# Altium schematic sheet CSI2-IMX8M-EVK-1_Rev02.SchDoc: CSI2-IMX8M-EVK
size A3; PageSetup: Record=PageOptions|CenterHorizontal=True|CenterVertical=True|PrintScale=0.73|XCorrection=1.00|YCorrection=1.00|PrintKind=2|BorderSize=5000000|LeftOffset=0|BottomOffset=0|Orientation=2|PaperLength=1000|PaperWidth=1000|Scale=100|PaperSource=7|PrintQuality=-4|MediaType=1|DitherType=10|PrintScaleMode=1|PaperKind=A3; CheckedBy: OFU/IHA; Author: CWA; CompanyName: Allied Vision Technologies GmbH; Address1: Taschenweg 2a; Address2: 07646 Stadtroda; Address3: Germany; Revision: 02; SheetNumber: 1; SheetTotal: 2
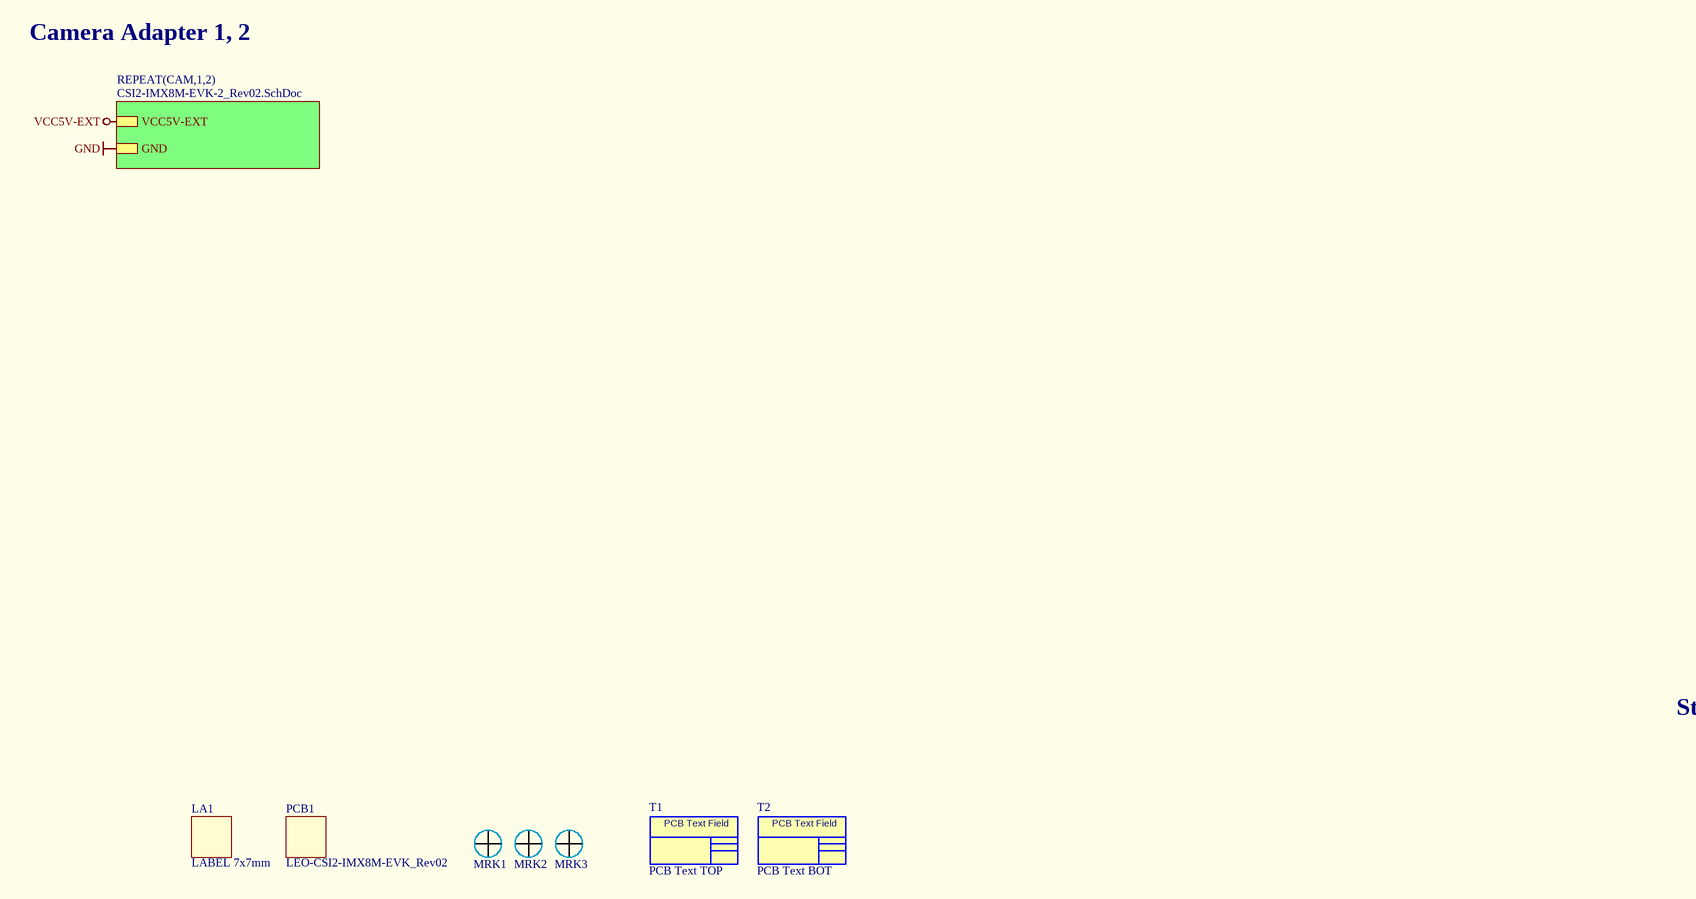
[diagram p0: CSI2-IMX8M-EVK-1_Rev02.SchDoc]

## Parts
LA1  LABEL 7x7mm  [PCB LABEL 7x7]
MRK1  Marker Single Layer  [PCB_Marker_Pad_top]  (value not drawn)
MRK2  Marker Single Layer  [PCB_Marker_Pad_top]  (value not drawn)
MRK3  Marker Single Layer  [PCB_Marker_Pad_top]  (value not drawn)
PCB1  LEO-CSI2-IMX8M-EVK_Rev02  (mechanical)
T1  PCB Text TOP  [PCB TEXTFIELD TOP 2]  (no BOM)
T2  PCB Text BOT  [PCB TEXTFIELD BOT 2]  (no BOM)

## Sub-sheets
REPEAT(CAM,1,2) = CSI2-IMX8M-EVK-2_Rev02.SchDoc: VCC5V-EXT, GND

## Nets
GND: sheet REPEAT(CAM,1,2)/GND
VCC5V-EXT: sheet REPEAT(CAM,1,2)/VCC5V-EXT

## Notes on the sheet
- Camera Adapter 1, 2
- Strict Hierarchical Design (Power Ports local)
- Title:
- PCB:
- PCBA:
- 3
- Confidential
- Author:
- Date:
- Checked by:
- Page:
- of
- 1
- 2
- File:
- No.
- Changes
- Rev.:
- Name:
- (in symbol PCB TEXT FIELD BOT) PCB Text Field
- (in symbol PCB TEXT FIELD TOP) PCB Text Field

## Library data of the parts
LA1 = PCB LABEL 7x7: Manufacturer: several; Manufacturer Part Number: several
MRK1-MRK3 = PCB Marker Pad Single Layer: Position Marker for PCBs
PCB1 = PCB: PCB ML04; Manufacturer: several
T1 = PCB TEXT FIELD TOP: PCB Textfield TOP
T2 = PCB TEXT FIELD BOT: PCB Textfield BOT